# Altium project music-hat.PrjPcb
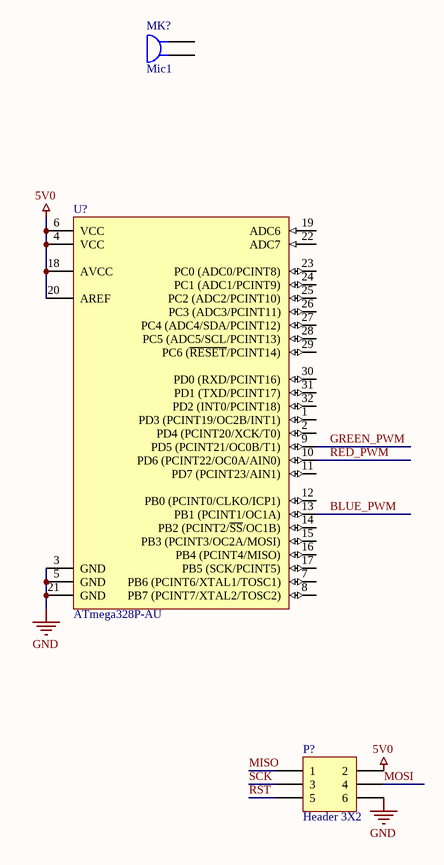
[diagram p0: Filter and Microcontroller.SchDoc]
3 sheets, 48 parts. Net scope: global (net labels, ports and power ports of the same name join across sheets).
Sheets:
  Filter and Microcontroller.SchDoc
  Power.SchDoc
  LED Driver.SchDoc

## Sheet Filter and Microcontroller.SchDoc
size Letter

### Parts
(Parts that share a designator on the sheet are numbered #1, #2 ... from top to bottom, then left to right.)
MK?  Mic1  [PIN2]
P?#1  Header 3X2  [HDR2X3]
U?  ATmega328P-AU  [32A_N]

### Nets
5V0: P?#1.2 U?.4(VCC) U?.6(VCC) U?.18(AVCC) U?.20(AREF)
GND: P?#1.6 U?.3(GND) U?.5(GND) U?.21(GND)
BLUE_PWM: U?.13(PB1_(PCINT1/OC1A))
GREEN_PWM: U?.9(PD5_(PCINT21/OC0B/T1))
MISO: P?#1.1
MOSI: P?#1.4
RED_PWM: U?.10(PD6_(PCINT22/OC0A/AIN0))
RST: P?#1.5
SCK: P?#1.3

Not connected (* = marked no-connect by the designer): MK? 1 2; U? 1(PD3_(PCINT19/OC2B/INT1)) 2(PD4_(PCINT20/XCK/T0)) 7(PB6_(PCINT6/XTAL1/TOSC1)) 8(PB7_(PCINT7/XTAL2/TOSC2)) 11(PD7_(PCINT23/AIN1)) 12(PB0_(PCINT0/CLKO/ICP1)) 14(PB2_(PCINT2/~{SS}/OC1B)) 15(PB3_(PCINT3/OC2A/MOSI)) 16(PB4_(PCINT4/MISO)) 17(PB5_(SCK/PCINT5)) 19(ADC6) 22(ADC7) 23(PC0_(ADC0/PCINT8)) 24(PC1_(ADC1/PCINT9)) 25(PC2_(ADC2/PCINT10)) 26(PC3_(ADC3/PCINT11)) 27(PC4_(ADC4/SDA/PCINT12)) 28(PC5_(ADC5/SCL/PCINT13)) 29(PC6_(~{RESET}/PCINT14)) 30(PD0_(RXD/PCINT16)) 31(PD1_(TXD/PCINT17)) 32(PD2_(INT0/PCINT18))

### Library data of the parts
MK? = Mic1: Microphone; Published: 24-Mar-1999; LatestRevisionDate: 17-Jul-2002; LatestRevisionNote: Re-released for DXP Platform.; PackageReference: PIN2; Publisher: Altium Limited
P?#1 = Header 3X2: Header, 3-Pin, Dual row; LatestRevisionDate: 17-Jul-2002; LatestRevisionNote: Re-released for DXP Platform.; Publisher: Altium Limited
U? = ATmega328P-AU: 8-bit AVR Microcontroller, 32KB Flash, 1KB EEPROM, 2KB SRAM, 32-pin TQFP, Industrial Grade (-40°C to 85°C); Published: 1-Apr-2010; DatasheetVersion: revA, Jan-2010; PackageVersion: revB, Oct-2001; PackageReference: 32A; Publisher: Altium Limited; PackageDescription: 32-Lead, 7x7x1.0 mm Body, 0.8mm Lead Pitch, Thin Profile Plastic Quad Flat Package (TQFP); Supplier 1: Digi-Key; Supplier Part Number 1: ATMEGA328P-AU-ND; Supplier 2: Farnell; Supplier Part Number 2: 1715486; Supplier 3: Mouser; Supplier Part Number 3: 556-ATMEGA328P-AU; Code_JEDEC: MS-026-ABA; ComponentLink1Description: Manufacturer Link; ComponentLink1URL: http://www.atmel.com/products/avr/default.asp?; ComponentLink2Description: ATmega48A/48PA/88A/88PA/168A/168PA/328/328P Datasheet; ComponentLink2URL: http://www.atmel.com/dyn/resources/prod_documents/8271.pdf; ComponentLink3Description: ATmega48A/48PA/88A/88PA/168A/168PA/328/328P Summary; ComponentLink3URL: http://www.atmel.com/dyn/resources/prod_documents/8271S.pdf; ComponentLink4Description: Atmel.com Home; ComponentLink4URL: http://www.atmel.com

## Sheet Power.SchDoc
size Letter
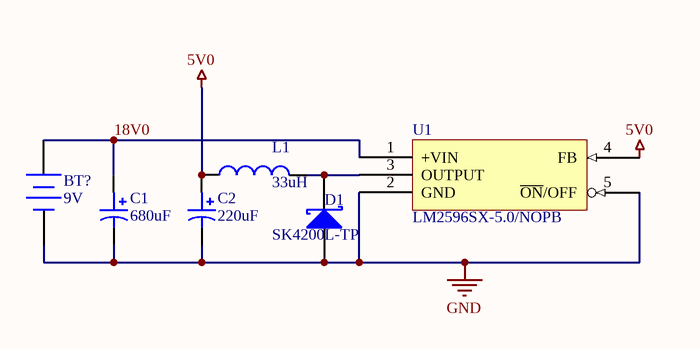
[diagram p1: Power.SchDoc]

### Parts
(Parts that share a designator on the sheet are numbered #1, #2 ... from top to bottom, then left to right.)
BT?  9V  [BAT-2]
C1  680uF  [Panasonic FM Series, Type A]
C2  220uF  [CAPMP7343X31N]
D1#1  SK4200L-TP  [DIOM6959X26N [DO-214AB]]
L1  33uH  [CDRH127]
U1  LM2596SX-5.0/NOPB  [TO-263-6, D2Pak]

### Nets
5V0: C2.1 L1.1 U1.4(FB)
GND: BT?.2(-) C1.2 C2.2 D1#1.2(A) U1.2(GND) U1.5(~{ON}/OFF)
18V0: BT?.1(+) C1.1 U1.1(+VIN)
NetD1#1_1: D1#1.1(K) L1.2 U1.3(OUTPUT)

### Library data of the parts
BT? = Battery: Multicell Battery; Published: 24-Mar-1999; LatestRevisionDate: 17-Jul-2002; LatestRevisionNote: Re-released for DXP Platform.; PackageReference: BAT-2; Publisher: Altium Limited; PackageDescription: Battery; 2 Leads
C1 = EEU-FM1E681: Panasonic CAP ALUM 680UF 25V 20% RADIAL; Value: 680uF; ComponentLink1Description: Datasheet; ComponentLink1URL: http://industrial.panasonic.com/www-data/pdf/ABA0000/ABA0000CE108.pdf; Supplier 1: Digi-Key; Supplier Part Number 1: P12390-ND
C2 = T491D227K010AT: Kemet CAP TANT 220UF 10V 10% 2917; Value: 220uF; Supplier 1: Digi-Key; Supplier Part Number 1: 399-8379-1-ND; ComponentLink1Description: Datasheet; ComponentLink1URL: http://www.kemet.com/Lists/ProductCatalog/Attachments/254/KEM_T2005_T491.pdf
D1#1 = SK4200L-TP: MCC DIODE SCHOTTKY 200V 4A DO214AB; ComponentLink1Description: Datasheet; ComponentLink1URL: http://www.mccsemi.com/up_pdf/SK4200L(SMC).pdf; Supplier 1: Digi-Key; Supplier Part Number 1: SK4200L-TPMSCT-ND
L1 = CDRH127NP-330MC: Sumida Fixed Inductors 33uH 3A; Value: 33uH; ComponentLink1Description: Datasheet; ComponentLink1URL: http://www.sumida.com/products/pdf/CDRH127,127LD.pdf
U1 = LM2596SX-5.0/NOPB: TI Power Converter 150 kHz  3A Step-Down Voltage Regulator; ComponentLink1URL: http://www.ti.com/lit/ds/symlink/lm2596.pdf; ComponentLink1Description: Datasheet; Supplier 1: Digi-Key; Supplier Part Number 1: LM2596SX-5.0/NOPBCT-ND

## Sheet LED Driver.SchDoc
size Letter
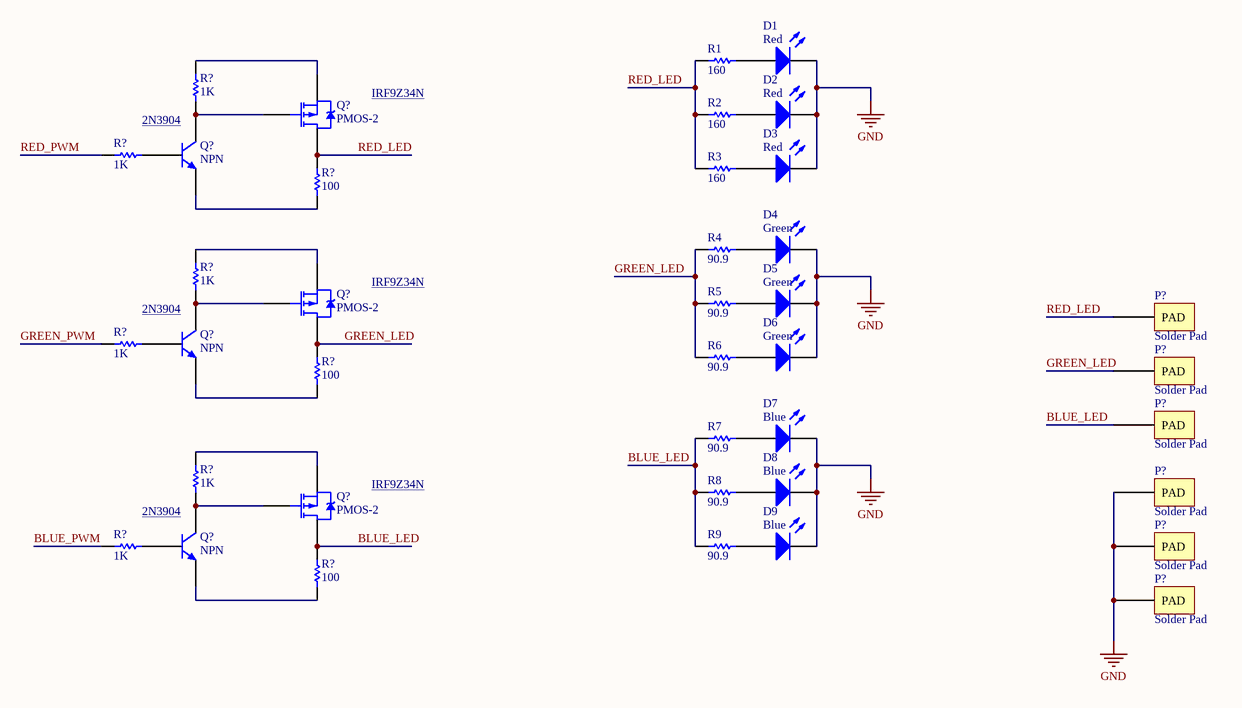
[diagram p2: LED Driver.SchDoc]

### Parts
(Parts that share a designator on the sheet are numbered #1, #2 ... from top to bottom, then left to right.)
D1#2  Red  [LED-5MM]
D2  Red  [LED-5MM]
D3  Red  [LED-5MM]
D4  Green  [LED-5MM]
D5  Green  [LED-5MM]
D6  Green  [LED-5MM]
D7  Blue  [LED-5MM]
D8  Blue  [LED-5MM]
D9  Blue  [LED-5MM]
P?#2  Solder Pad  [Solder Pad]
P?#3  Solder Pad  [Solder Pad]
P?#4  Solder Pad  [Solder Pad]
P?#5  Solder Pad  [Solder Pad]
P?#6  Solder Pad  [Solder Pad]
P?#7  Solder Pad  [Solder Pad]
Q?#1  PMOS-2  [TO-220AB]
Q?#2  NPN  [TO-226-AA]
Q?#3  PMOS-2  [TO-220AB]
Q?#4  NPN  [TO-226-AA]
Q?#5  PMOS-2  [TO-220AB]
Q?#6  NPN  [TO-226-AA]
R1  160  [RES_8085]
R2  160  [RES_8085]
R3  160  [RES_8085]
R4  90.9  [RES_8085]
R5  90.9  [RES_8085]
R6  90.9  [RES_8085]
R7  90.9  [RES_8085]
R8  90.9  [RES_8085]
R9  90.9  [RES_8085]
R?#1  1K  [RES_8085]
R?#2  1K  [RES_8085]
R?#3  100  [RES_8085]
R?#4  1K  [RES_8085]
R?#5  1K  [RES_8085]
R?#6  100  [RES_8085]
R?#7  1K  [RES_8085]
R?#8  1K  [RES_8085]
R?#9  100  [RES_8085]

### Nets
GND: D1#2.2(K) D2.2(K) D3.2(K) D4.2(K) D5.2(K) D6.2(K) D7.2(K) D8.2(K) D9.2(K) P?#5.0(PAD) P?#6.0(PAD) P?#7.0(PAD)
BLUE_LED: P?#4.0(PAD) Q?#5.2(D) R7.1 R8.1 R9.1 R?#9.2
BLUE_PWM: R?#8.1
GREEN_LED: P?#3.0(PAD) Q?#3.2(D) R4.1 R5.1 R6.1 R?#6.2
GREEN_PWM: R?#5.1
RED_LED: P?#2.0(PAD) Q?#1.2(D) R1.1 R2.1 R3.1 R?#3.2
RED_PWM: R?#2.1
NetD1#2_1: D1#2.1(A) R1.2
NetD2_1: D2.1(A) R2.2
NetD3_1: D3.1(A) R3.2
NetD4_1: D4.1(A) R4.2
NetD5_1: D5.1(A) R5.2
NetD6_1: D6.1(A) R6.2
NetD7_1: D7.1(A) R7.2
NetD8_1: D8.1(A) R8.2
NetD9_1: D9.1(A) R9.2
NetQ?#1_1: Q?#1.1(G) Q?#2.1(C) R?#1.1
NetQ?#1_3: Q?#1.3(S) R?#1.2
NetQ?#2_2: Q?#2.2(B) R?#2.2
NetQ?#2_3: Q?#2.3(E) R?#3.1
NetQ?#3_1: Q?#3.1(G) Q?#4.1(C) R?#4.1
NetQ?#3_3: Q?#3.3(S) R?#4.2
NetQ?#4_2: Q?#4.2(B) R?#5.2
NetQ?#4_3: Q?#4.3(E) R?#6.1
NetQ?#5_1: Q?#5.1(G) Q?#6.1(C) R?#7.1
NetQ?#5_3: Q?#5.3(S) R?#7.2
NetQ?#6_2: Q?#6.2(B) R?#8.2
NetQ?#6_3: Q?#6.3(E) R?#9.1

### Notes on the sheet
- IRF9Z34N
- 2N3904

### Library data of the parts
D1#2 D2-D9 = D_LED: General Purpose LED; ComponentLink2Description: Green 5mm (C503B-GCS-CY0C0791); ComponentLink1URL: http://www.cree.com/~/media/Files/Cree/LED%20Components%20and%20Modules/HB/Data%20Sheets/C503B%20RAS%20RAN%20AAS%20AAN%20RBS%20RBN%20ABS%20ABN%20RCS%20RCN%20ACS%20ACN%201079.pdf; Supplier 1: Digi-Key; Supplier 2: Digi-Key; Supplier 3: Digi-Key; Supplier Part Number 1: C503B-GCS-CY0C0791-ND; Supplier Part Number 2: C503B-BAN-CY0C0461-ND; Supplier Part Number 3: C503B-RAS-CY0B0AA1-ND; ComponentLink3Description: Blue 5mm (C503B-BAN-CY0C0461); ComponentLink1Description: Red 5mm (C503B-RAS-CY0B0AA1); ComponentLink2URL: http://www.cree.com/~/media/Files/Cree/LED%20Components%20and%20Modules/HB/Data%20Sheets/C503B%20BAS%20BAN%20BCS%20BCN%20GAS%20GAN%20GCS%20GCN%201094.pdf; ComponentLink3URL: http://www.cree.com/sitecore%20modules/web/~/media/Files/Cree/LED%20Components%20and%20Modules/HB/Data%20Sheets/1300%20C503B%20BAS%20BAN%20GAS%20GAN.pdf
Q?#1 Q?#3 Q?#5 = PMOS-2: P-Channel Power MOSFET; Note: Pin 4 not drawn and electrically connected to Pin 2.; Published: 8-Jun-2000; LatestRevisionDate: 17-Jul-2002; LatestRevisionNote: Re-released for DXP Platform.; DatasheetVersion: PD-9.390D; PackageVersion: Feb-1997; PackageReference: TO-220AB; Publisher: Altium Limited; PackageDescription: TO, Thru-Hole, Vertical, Heatsink Mounted; 3 In-Line Leads; Pitch 2.54 mm; ComponentLink1Description: Manufacturer Link; ComponentLink1URL: http://www.irf.com/
Q?#2 Q?#4 Q?#6 = NPN: NPN Bipolar Transistor; Published: 8-Jun-2000; LatestRevisionDate: 17-Jul-2002; LatestRevisionNote: Re-released for DXP Platform.; PackageReference: TO-226-AA; Publisher: Altium Limited; PackageDescription: TO, Flat Index; 3 In-Line, Axial Leads; Body Dia. 4.8mm; Leads 0.55 x 0.51 mm (max); Code_JEDEC: TO-226-AA
R1-R9 R?#1-R?#9 = CHIP-RES: SMD Chip Resistor
  R1-R3: Value: 160
  R4-R9: Value: 90.9
  R?#1 R?#2 R?#4 R?#5 R?#7 R?#8: Value: 1K
  R?#3 R?#6 R?#9: Value: 100

## Nets that join several sheets
5V0: Filter and Microcontroller (5 pins), Power (C2.1 L1.1 U1.4)
GND: Filter and Microcontroller (P?#1.6 U?.3 U?.5 U?.21), Power (6 pins), LED Driver (12 pins)
BLUE_PWM: Filter and Microcontroller (U?.13), LED Driver (R?#8.1)
GREEN_PWM: Filter and Microcontroller (U?.9), LED Driver (R?#5.1)
RED_PWM: Filter and Microcontroller (U?.10), LED Driver (R?#2.1)